# EAGLE schematic main (EAGLE 7.7.0)

## Sheet 1 of 2
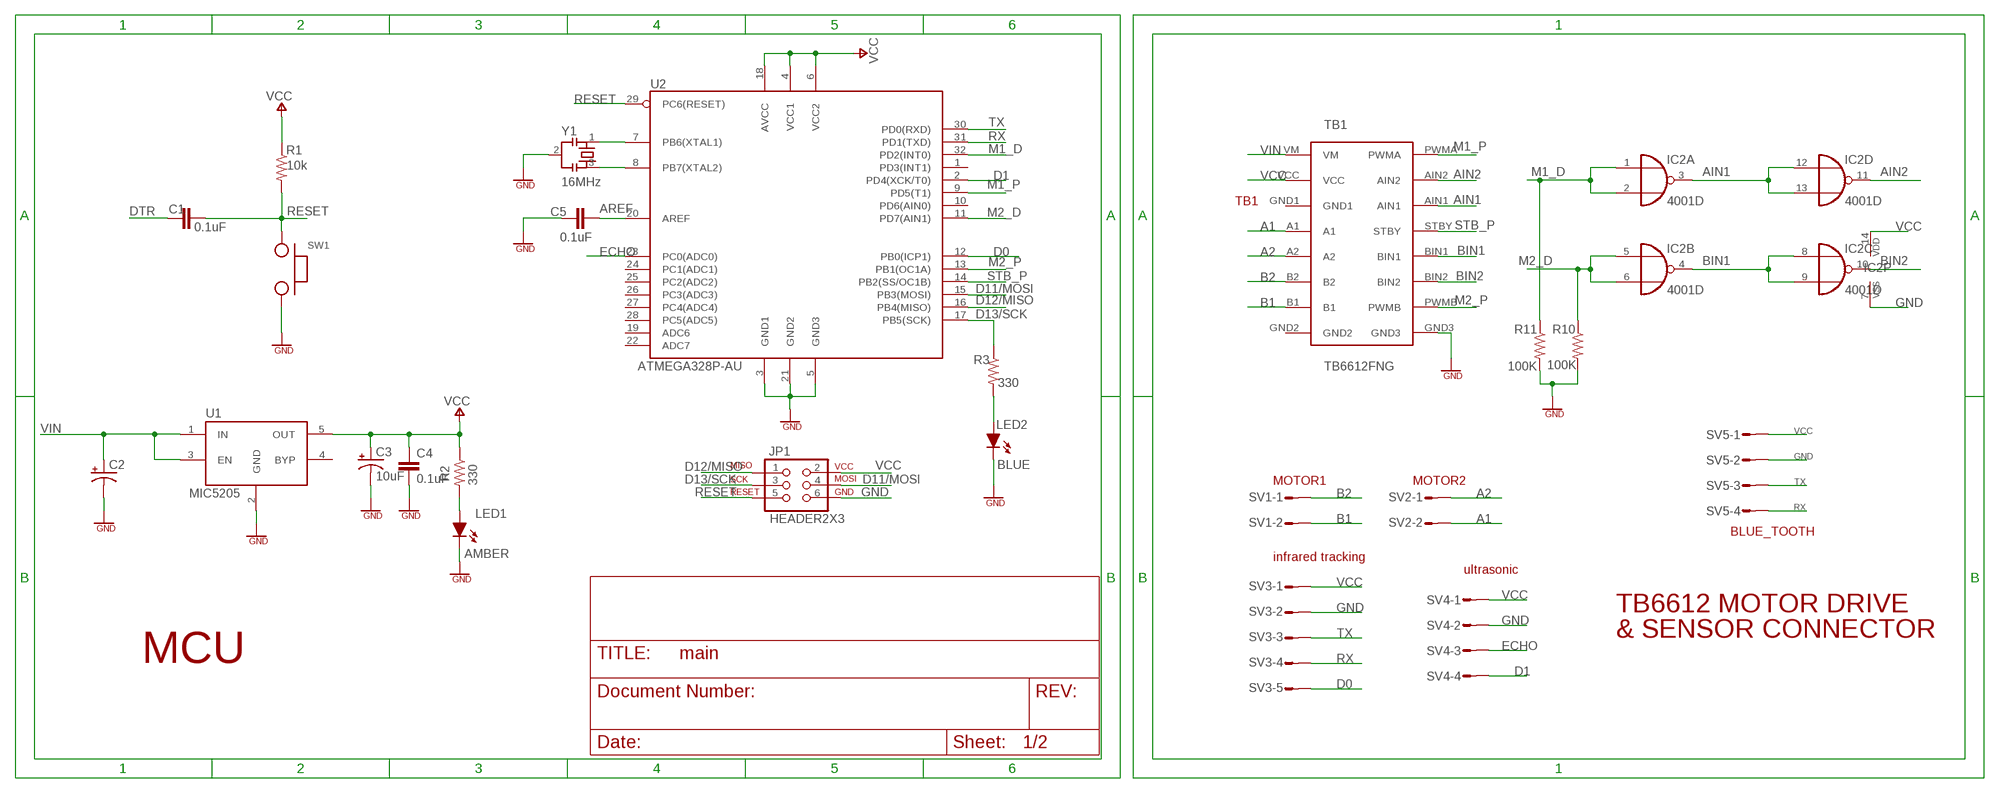
[diagram p0: schematic, sheet 1]

### Parts
C1  0.1uF  CAP_0603  [SMD0603]
C2  CAP_TANT  [EIA3216]
C3  10uF  CAP_TANT  [EIA3216]
C4  0.1uF  CAP_0603  [SMD0603]
C5  0.1uF  CAP_0603  [SMD0603]
IC2  4001D  [SO14]
JP1  HEADER2X3  [2X3]
LED1  AMBER  LED_0603  [LED_0603]
LED2  BLUE  LED_0805  [LED_0805]
R1  10k  RES_0603  [SMD0603]
R2  330  RES_0603  [SMD0603]
R3  330  RES_0603  [SMD0603]
R10  100K  RES_0603  [SMD0603]
R11  100K  RES_0603  [SMD0603]
SV1  L02P  [L02P]
SV2  L02P  [L02P]
SV3  L05P  [L05P]
SV4  MT6-4  [MT6-4]
SV5  MT6-4  [MT6-4]
SW1  SWITCH  [SWITCH-SPST]
TB1  TB6612FNG  [TB6612FNG]
U1  MIC5205  [SOT23-5]
U2  ATMEGA328P-AU  [TQFP32]
Y1  16MHz  CSTCE  [CSTCE]

### Nets
A1: SV2.2 TB1.A1
A2: SV2.1 TB1.A2
AIN1: IC2.3(A:O) IC2.12(D:I0) IC2.13(D:I1) TB1.AIN1
AIN2: IC2.11(D:O) TB1.AIN2
AREF: C5.2 U2.20(AREF)
B1: SV1.2 TB1.B1
B2: SV1.1 TB1.B2
BIN1: IC2.4(B:O) IC2.8(C:I0) IC2.9(C:I1) TB1.BIN1
BIN2: IC2.10(C:O) TB1.BIN2
D0: SV3.5 U2.12(PB0(ICP1))
D1: SV4.4 U2.2(PD4(XCK/T0))
D11/MOSI: JP1.4 U2.15(PB3(MOSI))
D12/MISO: JP1.1 U2.16(PB4(MISO))
D13/SCK: JP1.3 R3.1 U2.17(PB5(SCK))
DTR: C1.2 ; also sheet 2
ECHO: SV4.3 U2.23(PC0(ADC0))
GND: C2.C(-) C3.C(-) C4.2 C5.1 IC2.7(P:VSS) JP1.6 LED1.C LED2.C R10.2 R11.2 SV3.2 SV4.2 SV5.2 SW1.2 TB1.GND3 U1.2(GND) U2.3(GND1) U2.5(GND3) U2.21(GND2) Y1.2 ; also sheet 2
M1_D: IC2.1(A:I0) IC2.2(A:I1) R11.1 U2.32(PD2(INT0))
M1_P: TB1.PWMA U2.9(PD5(T1))
M2_D: IC2.5(B:I0) IC2.6(B:I1) R10.1 U2.11(PD7(AIN1))
M2_P: TB1.PWMB U2.13(PB1(OC1A))
N$1: LED1.A R2.2
N$2: U2.7(PB6(XTAL1)) Y1.1
N$4: U2.8(PB7(XTAL2)) Y1.3
N$11: LED2.A R3.2
RESET: C1.1 JP1.5 R1.2 SW1.1 U2.29(PC6(RESET))
RX: SV3.4 SV5.4 U2.31(PD1(TXD)) ; also sheet 2
STB_P: TB1.STBY U2.14(PB2(SS/OC1B))
TX: SV3.3 SV5.3 U2.30(PD0(RXD)) ; also sheet 2
VCC: C3.A(+) C4.1 IC2.14(P:VDD) JP1.2 R1.1 R2.1 SV3.1 SV4.1 SV5.1 TB1.VCC U1.5(OUT) U2.4(VCC1) U2.6(VCC2) U2.18(AVCC) ; also sheet 2
VIN: C2.A(+) TB1.VM U1.1(IN) U1.3(EN) ; also sheet 2
Unconnected: TB1.GND1 TB1.GND2 U1.4(BYP) U2.1(PD3(INT1)) U2.10(PD6(AIN0)) U2.19(ADC6) U2.22(ADC7) U2.24(PC1(ADC1)) U2.25(PC2(ADC2)) U2.26(PC3(ADC3)) U2.27(PC4(ADC4)) U2.28(PC5(ADC5))

### Notes on the sheet
- MOTOR1 | MOTOR2
- BLUE_TOOTH
- infrared tracking
- ultrasonic
- TB6612 MOTOR DRIVE
- & SENSOR CONNECTOR
- MCU

## Sheet 2 of 2
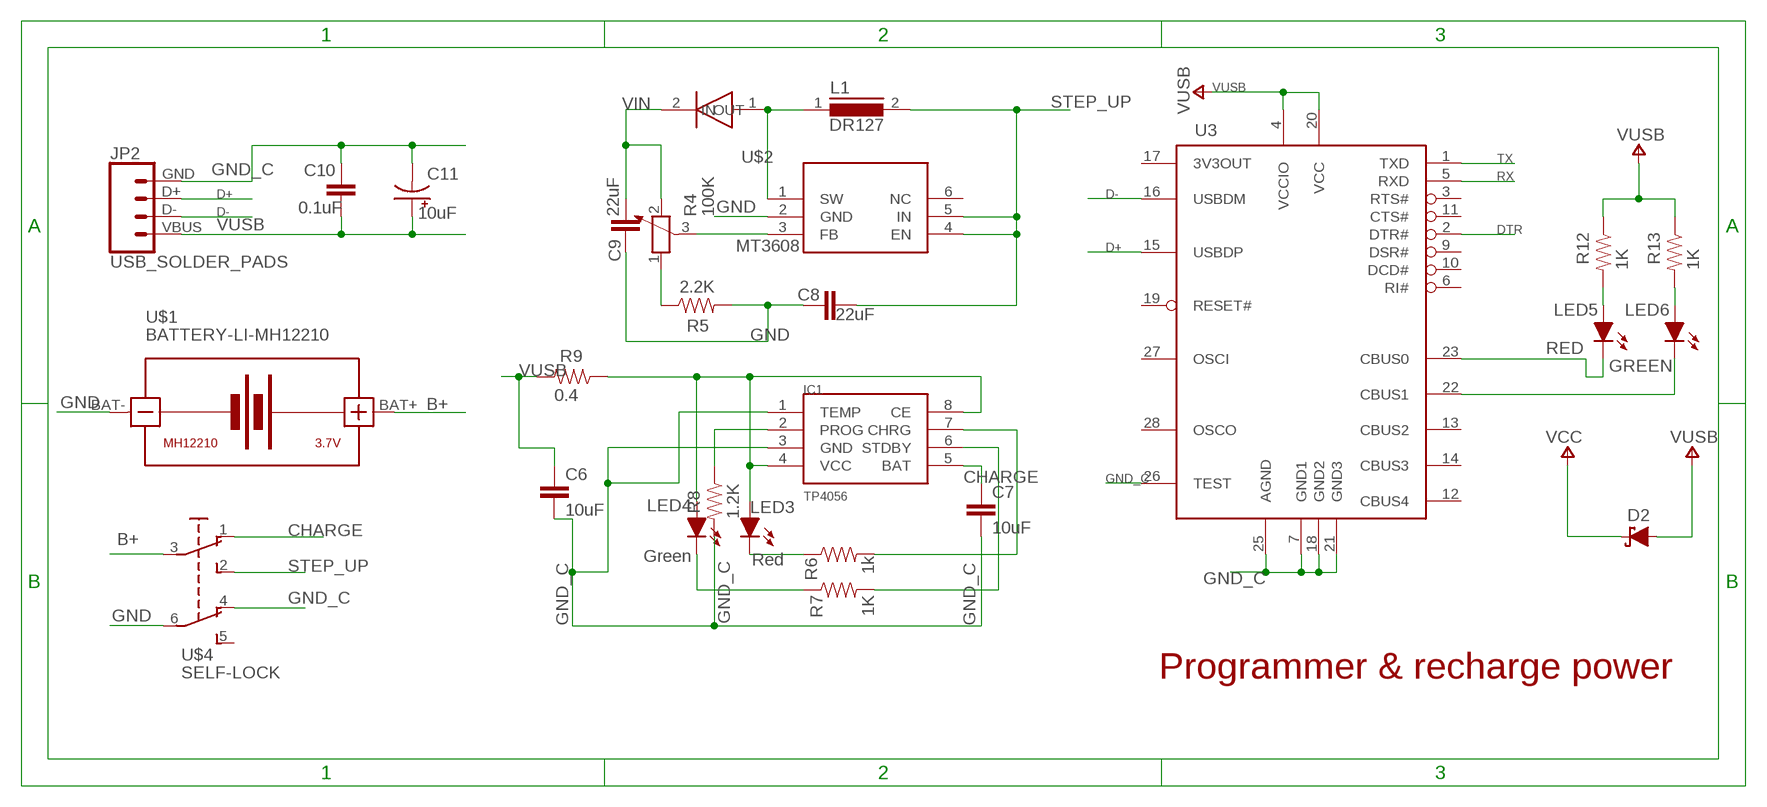
[diagram p1: schematic, sheet 2]

### Parts
C6  10uF  CAP_0805  [SMD0805]
C7  10uF  CAP_0805  [SMD0805]
C8  22uF  CAP_0805  [SMD0805]
C9  22uF  CAP_0805  [SMD0805]
C10  0.1uF  CAP_0603  [SMD0603]
C11  10uF  CAP_TANT  [EIA3216]
D2  SCHOTTKY  [SOD123]
IC1  TP4056  [SOP-8]
JP2  USB_SOLDER_PADS  [USB-SOLDER-PADS]
L1  DR127  [DR127]
LED3  Red  LED_0603  [LED_0603]
LED4  Green  LED_0603  [LED_0603]
LED5  RED  LED_0603  [LED_0603]
LED6  GREEN  LED_0603  [LED_0603]
R4  100K  POTENTIOMETER_PT-10  [PT-10]
R5  2.2K  RES_0603  [SMD0603]
R6  1k  RES_0603  [SMD0603]
R7  1K  RES_0603  [SMD0603]
R8  1.2K  RES_0603  [SMD0603]
R9  0.4  RES_0805  [SMD0805]
R12  1K  RES_0603  [SMD0603]
R13  1K  RES_0603  [SMD0603]
U3  FT232RL  [SSOP28DB]
U$1  BATTERY-LI-MH12210  [BATTERY-LI-MH12210]
U$2  MT3608  [SOT23-6]
U$3  SMA-SS34  [SMA-SS34]
U$4  SELF-LOCK  [SELF-LOCK]

### Nets
B+: U$1.BAT+ U$4.3
CHARGE: C7.1 IC1.5(BAT) U$4.1
D+: JP2.D+ U3.15(USBDP)
D-: JP2.D- U3.16(USBDM)
DTR: U3.2(DTR#) ; also sheet 1
GND: C8.1 C9.1 R5.2 U$1.BAT- U$2.2(GND) U$4.6 ; also sheet 1
GND_C: C6.2 C7.2 C10.1 C11.C(-) IC1.1(TEMP) IC1.3(GND) JP2.GND R8.2 U3.7(GND1) U3.18(GND2) U3.21(GND3) U3.25(AGND) U3.26(TEST) U$4.4
N$5: LED5.C U3.23(CBUS0)
N$6: L1.1 U$2.1(SW) U$3.1(IN)
N$7: LED3.C R6.1
N$8: R4.3 U$2.3(FB)
N$9: R4.1 R5.1
N$10: IC1.7(CHRG) R6.2
N$12: IC1.2(PROG) R8.1
N$13: IC1.6(STDBY) R7.2
N$14: LED4.C R7.1
N$15: LED6.C U3.22(CBUS1)
N$16: IC1.4(VCC) IC1.8(CE) LED3.A LED4.A R9.1
N$17: LED5.A R12.2
N$18: LED6.A R13.2
RX: U3.5(RXD) ; also sheet 1
STEP_UP: C8.2 L1.2 U$2.4(EN) U$2.5(IN) U$4.2
TX: U3.1(TXD) ; also sheet 1
VCC: D2.1(C) ; also sheet 1
VIN: C9.2 R4.2 U$3.2(OUT) ; also sheet 1
VUSB: C6.1 C10.2 C11.A(+) D2.2(A) JP2.VBUS R9.2 R12.1 R13.1 U3.4(VCCIO) U3.20(VCC)
Unconnected: U3.3(RTS#) U3.6(RI#) U3.9(DSR#) U3.10(DCD#) U3.11(CTS#) U3.12(CBUS4) U3.13(CBUS2) U3.14(CBUS3) U3.17(3V3OUT) U3.19(RESET#) U3.27(OSCI) U3.28(OSCO) U$2.6(NC) U$4.5

### Notes on the sheet
- Programmer & recharge power

## Library data of the parts
C1 C4-C10 = eagle-book:CAP: Non-polarized capacitor
C2 C3 C11 = eagle-book:CAP_TANT: Polarized capacitor (Tantalum)
D2 = eagle-book:SCHOTTKY: Schottky diode
IC1 = TP4056:TP4056
IC2 = 40xx:4001: Quad 2-input NOR
JP1 = eagle-book:HEADER2X3: 6-pin header with pins spaced 0.1" apart (HEADD6)
JP2 = SparkFun-Connectors:USB_SOLDER_PADS: Solder pad access to USB pins. Helpful to expose on PCBs so user can attach external USB connector if necessary.
L1 = inductors:DR127: High Power Density, High Efficiency, Shielded Inductors Source: coiltronics_dr_series.pdf
LED1-LED6 = eagle-book:LED: Light Emitting Diode
R1-R3 R5-R13 = eagle-book:RES: Resistor
R4 = rcl:POTENTIOMETER_: Potentiometer
SV1 SV2 = con-amp-mt:L02P: AMP MT CONNECTOR; OC_FARNELL: unknown; OC_NEWARK: unknown
SV3 = con-amp-mt:L05P: AMP MT CONNECTOR; OC_FARNELL: unknown; OC_NEWARK: unknown
SV4 SV5 = con-amp-mt:MT6-4: AMP MT6 CONNECTOR; OC_FARNELL: unknown; OC_NEWARK: unknown
SW1 = eagle-book:SWITCH: Two-input single pole, single throw (SPST) switch
TB1 = TB6612FNG:TB6612FNG
U1 = eagle-book:MIC5205: 5-volt voltage regulator (UA78M05)
U2 = eagle-book:ATMEGA328P: Atmel 32-pin 8-bit microcontroller
U3 = ftdichip-4:FT232RL: USB UART 4th Generation USB UART (USB <-> Serial) Controller
U$1 = diy-modules:BATTERY-LI-MH12210: Lithium-Ion MH12210 Rechargeable Battery Panasonic NCR18650PF battery datasheet available here: https://industrial.panasonic.com/cdbs/www-data/pdf2/ACI4000/ACI4000C12.pdf Click here to find device on ebay.com <http://www.ebay.com/sch/ncr18650b+battery>
U$2 = ltc_swr:MT3608
U$3 = SMA-SS34:SMA-SS34
U$4 = switch:SELF-LOCK
Y1 = eagle-book:CSTCE: SMD resonator from Murata (CSTCE16M0V53-S0)

## Net classes
0 default: width 0.203 mm
1 VCC: width 0.305 mm, drill 0.406 mm
2 VIN: width 0.305 mm, drill 0.406 mm
3 AREF: width 0.254 mm, drill 0.406 mm
4 GND: width 0.254 mm, drill 0.406 mm